# EAGLE design 2DD-17-mk-2.3 (EAGLE 9.2.2)
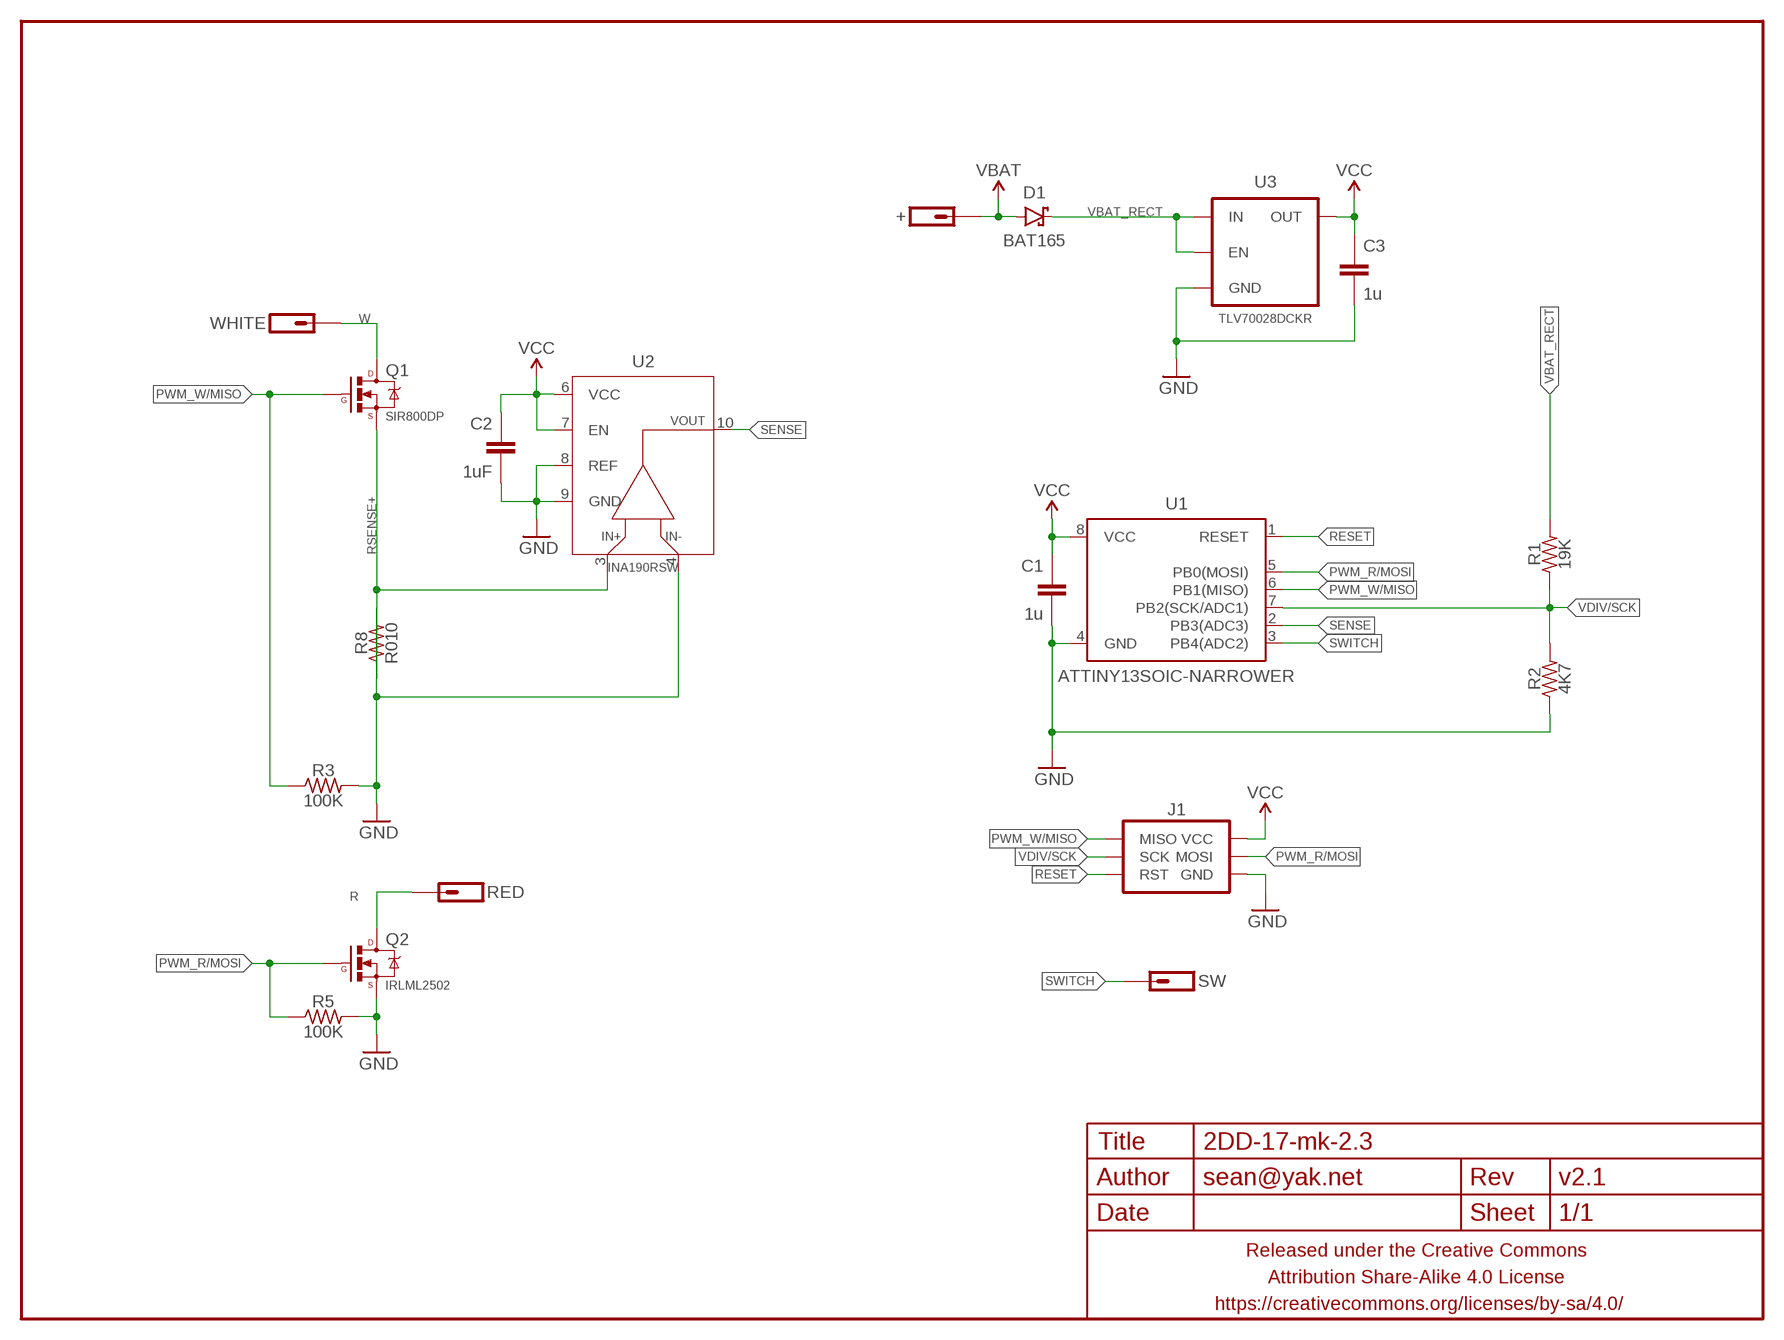
[diagram p0: schematic, sheet 1]

## Parts
+  M01PTH-1MM-CIR-NS  [1X01-1MM-CIR-NS]
C1  1u  CAPACITOR-CERAMICC0402  [C0402]
C2  1uF  CAPACITOR-CERAMICC0402  [C0402]
C3  1u  CAPACITOR-CERAMICC0402  [C0402]
D1  BAT165  DIODE-SCHOTTKYSOD323  [SOD323-SCHOTTKY]
FRAME1  FRAME-LETTERNO_PACKAGE  [DUMMY]
J1  AVR_SPI_PRG_6SMD-1.27MM  [2X3-1.27MM-SMD]
Q1  SIR800DP  MOSFET-NCHANNELPSMN4R0-30YLD  [LFPAK56]
Q2  IRLML2502  MOSFET-NCHANNELIRLML2502  [SOT23]
R1  19K  RESISTORR0402  [R0402]
R2  4K7  RESISTORR0402  [R0402]
R3  100K  RESISTORR0402  [R0402]
R5  100K  RESISTORR0402  [R0402]
R8  R010  RESISTORR1206  [R1206]
RED  M01SMD-1.25MM-DIA  [1X01-SMD-1.25DIA]
SW  M01SMD-1.25MM-DIA  [1X01-SMD-1.25DIA]
U1  ATTINY13SOIC-NARROWER  [SO08-SKINNYPADS]
U2  INA190RSW  [UQFN-10]
U3  TLV70028DCKR  V_REG_ENTLV700XXDCR  [SC70]
WHITE  M01SMD-1.25MM-DIA  [1X01-SMD-1.25DIA]

## Nets
GND: C1.2 C2.2 C3.2 J1.6(GND) Q2.2(S) R2.1 R3.2 R5.2 R8.2 U1.4(GND) U2.4(VIN-) U2.8(REF) U2.9(GND) U3.2(GND)
PWM_R/MOSI: J1.4(MOSI) Q2.1(G) R5.1 U1.5(PB0(MOSI))
PWM_W/MISO: J1.1(MISO) Q1.4(G) R3.1 U1.6(PB1(MISO))
R: Q2.3(D) RED.P$1
RESET: J1.5(RST) U1.1(RESET)
RSENSE+: Q1.1(S) Q1.2(S) Q1.3(S) R8.1 U2.3(VIN+)
SENSE: U1.2(PB3(ADC3)) U2.10(OUT)
SWITCH: SW.P$1 U1.3(PB4(ADC2))
VBAT: +.1 D1.A
VBAT_RECT: D1.C R1.2 U3.1(IN) U3.3(EN)
VCC: C1.1 C2.1 C3.1 J1.2(VCC) U1.8(VCC) U2.6(VCC) U2.7(EN) U3.5(OUT)
VDIV/SCK: J1.3(SCK) R1.1 R2.2 U1.7(PB2(SCK/ADC1))
W: Q1.PAD(D) WHITE.P$1

## Library data of the parts
+ RED SW WHITE = a_parts:M01: Header 1 Standard 1-pin 0.1" header. Use with straight break away headers (SKU : PRT-00116), right angle break away headers (PRT-00553), swiss pins (PRT-00743), machine pins (PRT-00117), and female headers (PRT-00115).
C1-C3 = a_parts:CAPACITOR-CERAMIC: CAPACITOR, European symbol
D1 = a_parts:DIODE-SCHOTTKY: Schottky diodes in SFE's production catalog BAT20J 1A 23V 0.62Vf RB751 120mA 40V 0.37Vf PMEG4005EJ 0.5A 40V 0.42Vf MBRA140 1A 40V 0.5Vf B340A 3A 40V SMA
FRAME1 = a_parts:FRAME-LETTER: Schematic Frame Standard 8.5x11 US Letter frame; DESIGNER: sean@yak.net; VERSION: v2.1
J1 = a_parts:AVR_SPI_PRG_6: AVR ISP 6 Pin This is the reduced ISP connector for AVR programming. Common on Arduino. This footprint will take up less PCB space and can be used with a 10-pin to 6-pin adapter such as SKU: BOB-08508 **Special note about "TEST_POINT" package. The stop mask is on the top side, so if you want your programming test points to be on the bottom of your board, make sure to place this package on the bottom side of the board. This also ensure that the orientation to program from the bottom side will be correct.
Q1 Q2 = a_parts:MOSFET-NCHANNEL: Common NMOSFET Parts MFG P/N Store ID Prod ID FDD8780 TRANS-09984 SI7820DN TRANS-11055 FDS6630A IC-08089 2N7002PW TRANS-11151 FQP30N06L COM-10213 TRANS-10060 BSS123LT1G TRANS-08345 BSS138 TRANS-00830 BS170 2N7000
R1-R3 R5 R8 = a_parts:RESISTOR: RESISTOR, American symbol
U1 = a_parts:ATTINY13: Atmel 8-pin 1kB flash uC
U2 = a_parts:INA190
U3 = a_parts:V_REG_EN

## Board
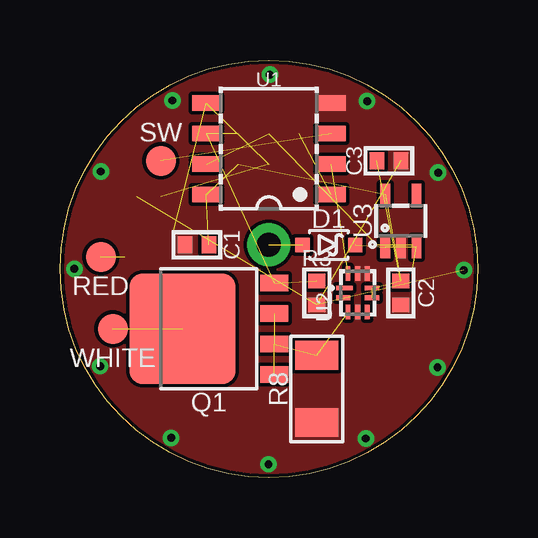
[diagram p1: board, top side]
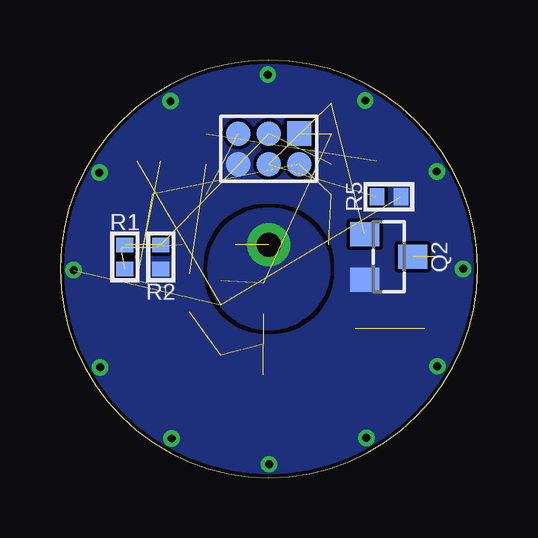
[diagram p2: board, bottom side, seen from below]

Size 17.4 x 17.4 mm. Coordinates in mm from the lower left corner, seen from the top.
Outline: 0,8.7 arc-180 17.4,8.7 arc-180 0,8.7
Copper layers (1*16): Top 0.0356mm / dielectric 1.5011mm / Bottom 0.0356mm
Design rules "LaenPCBOrder2 *": minimum track width 6mil, minimum drill 13mil, track to track 6mil, track to pad 6mil, pad to pad 6mil, via to via 6mil, smd to smd 6mil, copper to edge 6mil, drill to drill 6mil, minimum pad ring 7mil, minimum via ring 7mil, stop-mask expansion 3mil, vias tented up to drill 20mil, thermal gap 10mil

### Footprints (pad centres in the part's own frame; a part is rotated, then mirrored left to right if it is on the bottom)
1X01-1MM-CIR-NS = drill 1.016 pad 1.778: 1 0,0
C0402 = smd 0.6 x 0.7: 1 -0.5,0; 2 0.5,0
SOD323-SCHOTTKY = smd 0.6 x 0.6: A -1.1,0; C 1.1,0
2X3-1.27MM-SMD = smd 1.016 x 1.016: 1 -1.27,-0.635; 2 -1.27,0.635; 3 0,-0.635; 4 0,0.635; 5 1.27,-0.635; 6 1.27,0.635
LFPAK56 = smd 0.7 x 1.15: 1 -1.905,-2.725; 2 -0.635,-2.725; 3 0.635,-2.725; 4 1.905,-2.725 | smd 4.6 x 4.4: PAD 0,1.1
SOT23 = smd 1 x 1.2: 1 -0.95,-1; 2 0.95,-1; 3 0,1
R0402 = smd 0.6 x 0.7: 1 -0.5,0; 2 0.5,0
R1206 = smd 1.2 x 1.8: 1 -1.4,0; 2 1.4,0
1X01-SMD-1.25DIA = smd 1.25 x 1.25: P$1 0,0
SO08-SKINNYPADS = smd 0.65 x 1.2: 1 -1.905,-2.6; 2 -0.635,-2.6; 3 0.635,-2.6; 4 1.905,-2.6; 5 1.905,2.6; 6 0.635,2.6; 7 -0.635,2.6; 8 -1.905,2.6
UQFN-10 = smd 0.2 x 0.7: 1 -0.2,-0.55 | smd 0.2 x 0.6: 2 0.2,-0.6; 6 0.2,0.6; 7 -0.2,0.6 | smd 0.6 x 0.2: 3 0.8,-0.4; 4 0.8,0; 5 0.8,0.4; 8 -0.8,0.4; 9 -0.8,0; 10 -0.8,-0.4
SC70 = smd 0.4 x 0.9: 1 -0.65,-1.1; 2 0,-1.1; 3 0.65,-1.1; 4 0.65,1.1; 5 -0.65,1.1

### Placement (x,y rotation side)
+  8.7,9.7 0 top
C1  5.7,9.7 180 top
C2  14.2,7.7 270 top
C3  13.7,13.2 0 top
D1  11.2,9.7 0 top
FRAME1  -0.3,-0.3 0 top
J1  8.7,13.7 180 bottom
Q1  6.2,6.2 90 top
Q2  3.7,9.2 270 bottom
R1  14.7,9.2 270 bottom
R2  13.2,9.2 90 bottom
R3  10.7,7.7 270 top
R5  3.7,11.7 0 bottom
R8  10.7,3.7 270 top
RED  1.7,9.2 180 top
SW  4.2,13.2 0 top
U1  8.7,13.7 90 top
U2  12.4,7.7 270 top
U3  14.2,10.7 0 top
WHITE  2.2,6.2 180 top

### Tracks (layer width: path | path; a pad name or v marks a point on that pad's centre or on a via)
GND  (via drill 0.33)  (3 unrouted)
  other vias: 0.6,8.7 1.7,12.75 4.68,15.71 8.74,16.79 12.8,15.69 15.76,12.71 16.83,8.64 15.73,4.59 12.75,1.63 8.69,0.56 4.63,1.66 1.67,4.64
  pour Top (rank 6, no thermals): -0.3,-0.3 -0.3,17.7 17.7,17.7 17.7,-0.3
  pour Bottom (rank 6, no thermals): 17.7,-0.3 17.7,17.7 -0.3,17.7 -0.3,-0.3
PWM_R/MOSI  (3 unrouted)
PWM_W/MISO  (3 unrouted)
R  (1 unrouted)
RESET  (1 unrouted)
RSENSE+  (4 unrouted)
SENSE  (1 unrouted)
SWITCH  (1 unrouted)
VBAT  (1 unrouted)
  pour Bottom (rank 5, no thermals): 6.2,8.7 arc-90 8.7,11.2 arc-90 11.2,8.7 arc-90 8.7,6.2 arc-90
VBAT_RECT  (3 unrouted)
VCC  (7 unrouted)
VDIV/SCK  (3 unrouted)
W  (1 unrouted)